# Altium schematic sheet Quadrature Mixers [FIXED WITH BIASING].SchDoc
size B; SheetNumber: 3; SheetTotal: 4
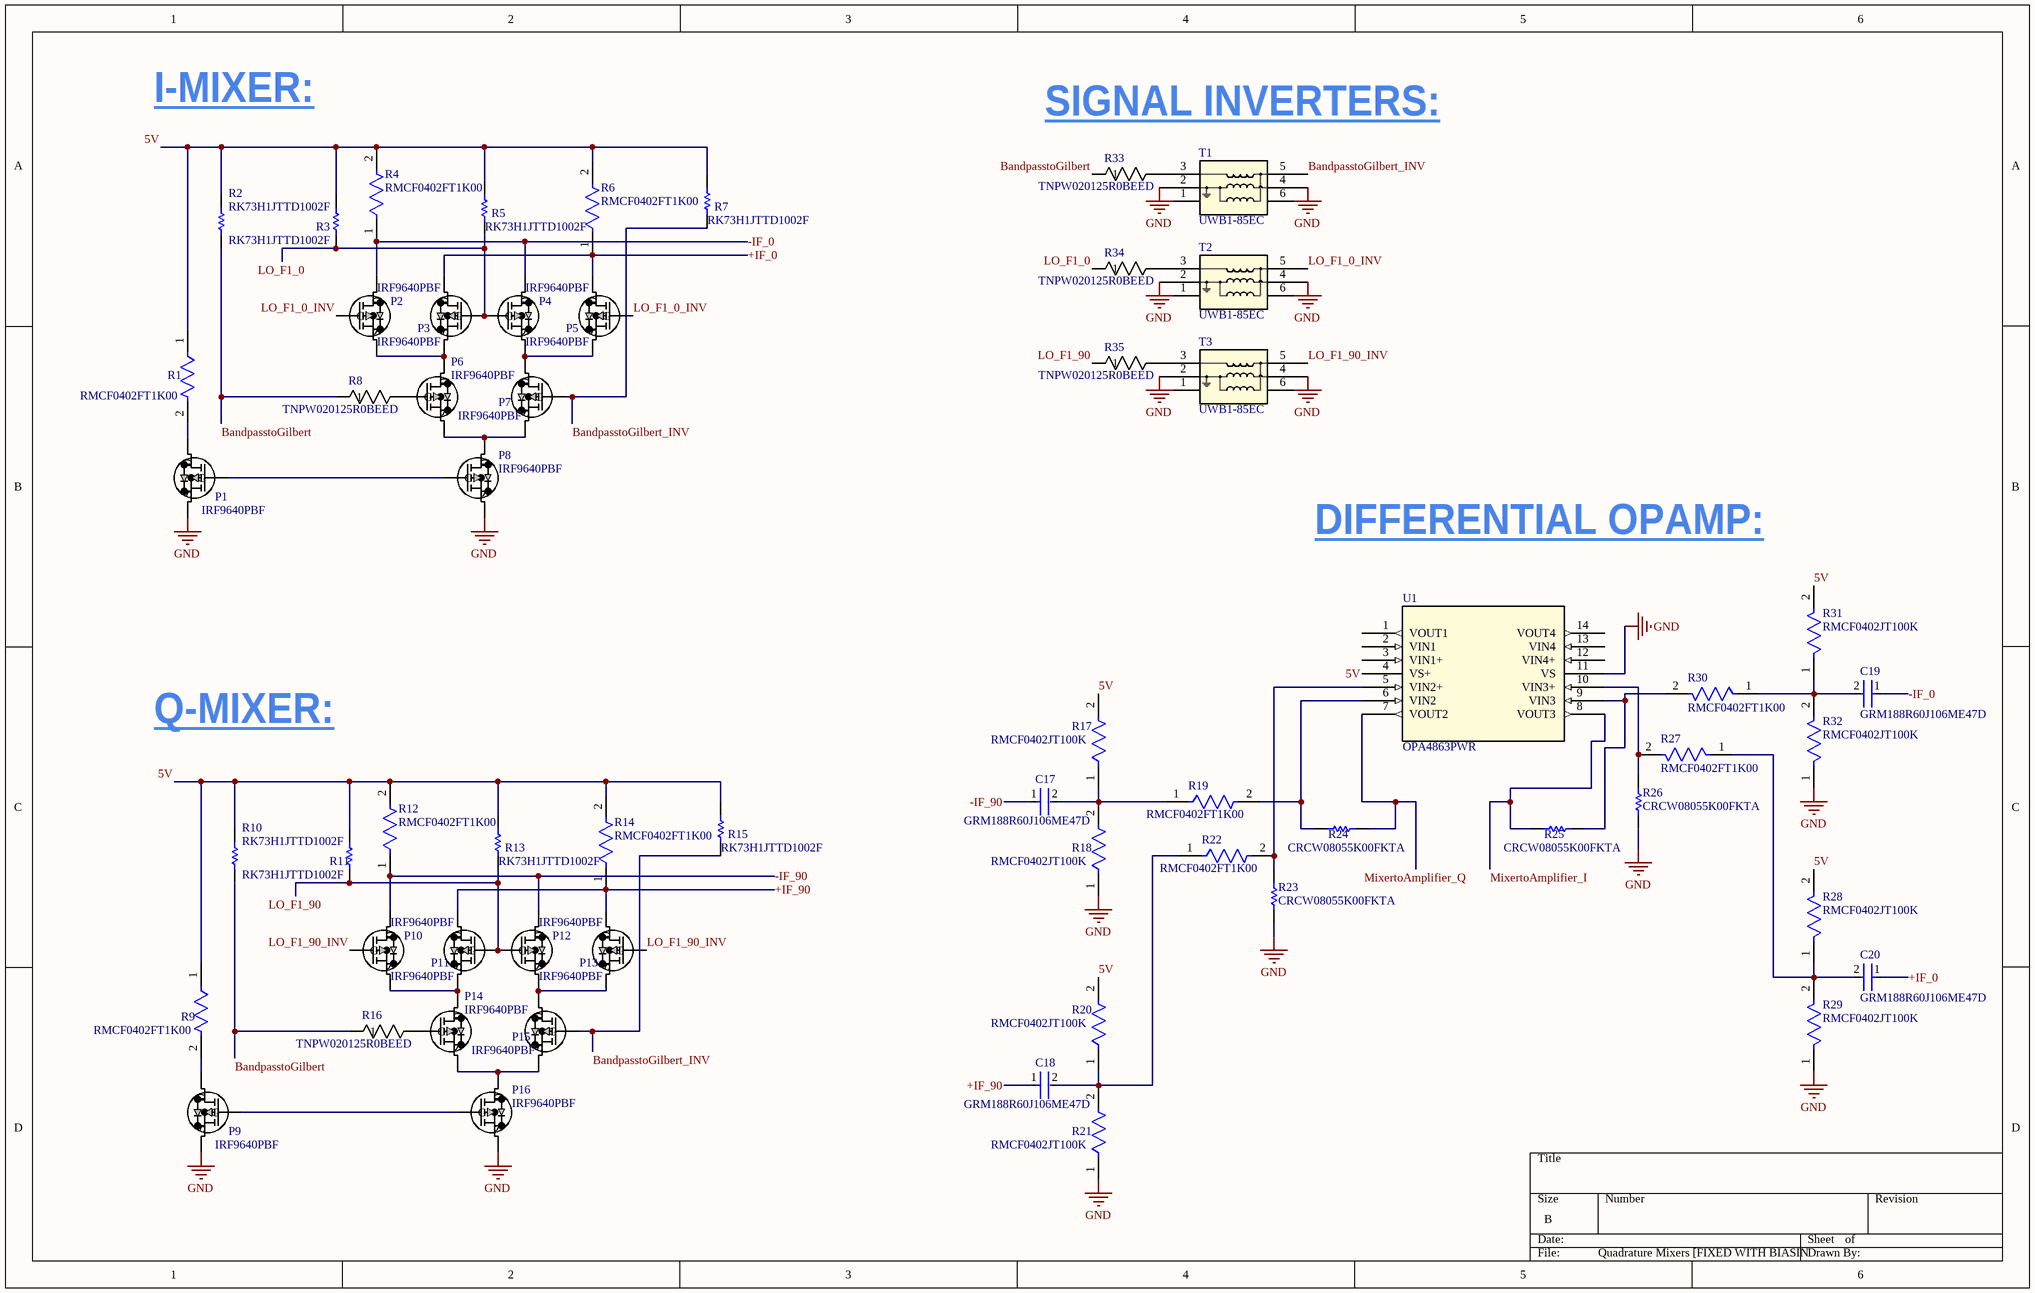
[diagram p0: Quadrature Mixers [FIXED WITH BIASING].SchDoc]

## Parts
C17  GRM188R60J106ME47D  [FP-GRM188-0_1-e0_2_0_55-IPC_A]
C18  GRM188R60J106ME47D  [FP-GRM188-0_1-e0_2_0_55-IPC_A]
C19  GRM188R60J106ME47D  [FP-GRM188-0_1-e0_2_0_55-IPC_A]
C20  GRM188R60J106ME47D  [FP-GRM188-0_1-e0_2_0_55-IPC_A]
P1  IRF9640PBF  [TO220AB_VIS]
P2  IRF9640PBF  [TO220AB_VIS]
P3  IRF9640PBF  [TO220AB_VIS]
P4  IRF9640PBF  [TO220AB_VIS]
P5  IRF9640PBF  [TO220AB_VIS]
P6  IRF9640PBF  [TO220AB_VIS]
P7  IRF9640PBF  [TO220AB_VIS]
P8  IRF9640PBF  [TO220AB_VIS]
P9  IRF9640PBF  [TO220AB_VIS]
P10  IRF9640PBF  [TO220AB_VIS]
P11  IRF9640PBF  [TO220AB_VIS]
P12  IRF9640PBF  [TO220AB_VIS]
P13  IRF9640PBF  [TO220AB_VIS]
P14  IRF9640PBF  [TO220AB_VIS]
P15  IRF9640PBF  [TO220AB_VIS]
P16  IRF9640PBF  [TO220AB_VIS]
R1  RMCF0402FT1K00  [FP-RMCF0402-MFG]
R2  RK73H1JTTD1002F  [RESC1608X55X30ML20T10]
R3  RK73H1JTTD1002F  [RESC1608X55X30ML20T10]
R4  RMCF0402FT1K00  [FP-RMCF0402-MFG]
R5  RK73H1JTTD1002F  [RESC1608X55X30ML20T10]
R6  RMCF0402FT1K00  [FP-RMCF0402-MFG]
R7  RK73H1JTTD1002F  [RESC1608X55X30ML20T10]
R8  TNPW020125R0BEED  [RES_TNPW0201_VIS]
R9  RMCF0402FT1K00  [FP-RMCF0402-MFG]
R10  RK73H1JTTD1002F  [RESC1608X55X30ML20T10]
R11  RK73H1JTTD1002F  [RESC1608X55X30ML20T10]
R12  RMCF0402FT1K00  [FP-RMCF0402-MFG]
R13  RK73H1JTTD1002F  [RESC1608X55X30ML20T10]
R14  RMCF0402FT1K00  [FP-RMCF0402-MFG]
R15  RK73H1JTTD1002F  [RESC1608X55X30ML20T10]
R16  TNPW020125R0BEED  [RES_TNPW0201_VIS]
R17  RMCF0402JT100K  [FP-RMCF0402-MFG]
R18  RMCF0402JT100K  [FP-RMCF0402-MFG]
R19  RMCF0402FT1K00  [FP-RMCF0402-MFG]
R20  RMCF0402JT100K  [FP-RMCF0402-MFG]
R21  RMCF0402JT100K  [FP-RMCF0402-MFG]
R22  RMCF0402FT1K00  [FP-RMCF0402-MFG]
R23  CRCW08055K00FKTA  [RESC2013X50X30ML20T20]
R24  CRCW08055K00FKTA  [RESC2013X50X30ML20T20]
R25  CRCW08055K00FKTA  [RESC2013X50X30ML20T20]
R26  CRCW08055K00FKTA  [RESC2013X50X30ML20T20]
R27  RMCF0402FT1K00  [FP-RMCF0402-MFG]
R28  RMCF0402JT100K  [FP-RMCF0402-MFG]
R29  RMCF0402JT100K  [FP-RMCF0402-MFG]
R30  RMCF0402FT1K00  [FP-RMCF0402-MFG]
R31  RMCF0402JT100K  [FP-RMCF0402-MFG]
R32  RMCF0402JT100K  [FP-RMCF0402-MFG]
R33  TNPW020125R0BEED  [RES_TNPW0201_VIS]
R34  TNPW020125R0BEED  [RES_TNPW0201_VIS]
R35  TNPW020125R0BEED  [RES_TNPW0201_VIS]
T1  UWB1-85EC  [UWB1UWB2_COC]
T2  UWB1-85EC  [UWB1UWB2_COC]
T3  UWB1-85EC  [UWB1UWB2_COC]
U1  OPA4863PWR  [PW14_TEX]

## Nets
GND: P1.3(S) P8.3(S) P9.3(S) P16.3(S) R18.1 R21.1 R23.1 R26.1 R29.1 R32.1 T1.2 T1.4 T2.2 T2.4 T3.2 T3.4 U1.11(VS)
5V: R1.1 R2.2 R3.2 R4.2 R5.2 R6.2 R7.2 R9.1 R10.2 R11.2 R12.2 R13.2 R14.2 R15.2 R17.2 R20.2 R28.2 R31.2 U1.4(VS+)
+IF_0: C20.1 P3.2(D) P5.2(D) R6.1
+IF_90: C18.1 P11.2(D) P13.2(D) R14.1
-IF_0: C19.1 P2.2(D) P4.2(D) R4.1
-IF_90: C17.1 P10.2(D) P12.2(D) R12.1
BandpasstoGilbert: R2.1 R8.1 R10.1 R16.1 R33.1
BandpasstoGilbert_INV: P7.1(G) P15.1(G) R7.1 R15.1 T1.5
LO_F1_0: P3.1(G) P4.1(G) R3.1 R5.1 R34.1
LO_F1_0_INV: P2.1(G) P5.1(G) T2.5
LO_F1_90: P11.1(G) P12.1(G) R11.1 R13.1 R35.1
LO_F1_90_INV: P10.1(G) P13.1(G) T3.5
MixertoAmplifier_I: R25.1 U1.8(VOUT3)
MixertoAmplifier_Q: R24.2 U1.7(VOUT2)
NetC17_2: C17.2 R17.1 R18.2 R19.1
NetC18_2: C18.2 R20.1 R21.2 R22.1
NetC19_2: C19.2 R30.1 R31.1 R32.2
NetC20_2: C20.2 R27.1 R28.1 R29.2
NetP1_1: P1.1(G) P8.1(G)
NetP1_2: P1.2(D) R1.2
NetP2_3: P2.3(S) P3.3(S) P6.2(D)
NetP4_3: P4.3(S) P5.3(S) P7.2(D)
NetP6_1: P6.1(G) R8.2
NetP6_3: P6.3(S) P7.3(S) P8.2(D)
NetP9_1: P9.1(G) P16.1(G)
NetP9_2: P9.2(D) R9.2
NetP10_3: P10.3(S) P11.3(S) P14.2(D)
NetP12_3: P12.3(S) P13.3(S) P15.2(D)
NetP14_1: P14.1(G) R16.2
NetP14_3: P14.3(S) P15.3(S) P16.2(D)
NetR19_2: R19.2 R24.1 U1.6(VIN2)
NetR22_2: R22.2 R23.2 U1.5(VIN2+)
NetR25_2: R25.2 R30.2 U1.9(VIN3)
NetR26_2: R26.2 R27.2 U1.10(VIN3+)
NetR33_2: R33.2 T1.3
NetR34_2: R34.2 T2.3
NetR35_2: R35.2 T3.3

Not connected (* = marked no-connect by the designer): T1 1 6; T2 1 6; T3 1 6; U1 1(VOUT1) 2(VIN1) 3(VIN1+) 12(VIN4+) 13(VIN4) 14(VOUT4)

## Notes on the sheet
- I-MIXER:
- SIGNAL INVERTERS:
- DIFFERENTIAL OPAMP:
- Q-MIXER:

## Library data of the parts
C17-C20 = CMP-2006-02792-2: Chip Multilayer Ceramic Capacitors for General Purpose, 0603, 10uF, X5R, 15%, 20%, 6.3V; Packaging: Tape and Reel; Voltage Rating (DC): 6.3V; Width: 0.031inch; Termination: SMD/SMT; Dielectric: X5R; Package Quantity: 4000; Voltage Rating: 6.3V; Capacitance: 10uF; Case/Package: 0603; Min Operating Temperature: -55°C; Voltage: 6.3V; Length: 1.6mm; Thickness: 0.035inch; Lead Free: Lead Free; Depth: 0.8mm; Case Code (Imperial): 0603; Max Operating Temperature: 85°C; Material: Ceramic; Height: 0.8mm; Tolerance: 20%; Mount: Surface Mount; REACH SVHC: No SVHC; Radiation Hardening: No; Case Code (Metric): 1608
P1-P16 = IRF9640PBF: No Description Available; Mfr_Name: Vishay
R1 R4 R6 R9 R12 R14 R19 R22 R27 R30 = CMP-26527-000026-1: 1kΩ ±1% 0.063W 0402 Thick Film Chip Resistor AEC-Q200 compliant; Resistance: 1kR; Temperature Coefficient: 100ppm/°C; Power Rating: 63mW; Length: 1mm; RoHS Compliant: Yes; Construction: Rectangular; Height: 0.016inch; Size Code: 0402; Lead Free: Lead Free; Radiation Hardening: No; Tolerance: 1%; Width: 0.02inch; Military Standard: Not; Resistor Type: Thick Film; Number of Terminations: 2; Min Operating Temperature: -55°C; Max Operating Temperature: 155°C; Depth: 0.5mm; Features: Automotive AEC-Q200; Packaging: Tape and Reel; Case Code (Metric): 1005; Mount: Surface Mount; Contact Plating: Tin; Max Power Dissipation: 63mW; Case/Package: 0402; Case Code (Imperial): 0402; Series: RMCF
R2 R3 R5 R7 R10 R11 R13 R15 = CMP-2000-01099-1: Manufacturer: KOA Speer; Part Number: RK73H1JTTD1002F
R8 R16 R33-R35 = TNPW020125R0BEED: RES 25 OHM 0.1% 0.075W 0201; Mfr_Name: Vishay
R17 R18 R20 R21 R28 R29 R31 R32 = CMP-26527-006953-1: 100kΩ ±5% 0.063W 0402 Thick Film Chip Resistor AEC-Q200 compliant; Working Voltage: 50V; Temperature Coefficient: 100ppm/°C; Power Rating: 62.5mW; Resistance: 100kR; Max Power Dissipation: 63mW; Military Standard: Not; Features: Automotive AEC-Q200; Case Code (Metric): 1005; Max Operating Temperature: 155°C; Lead Free: Lead Free; Series: RMCF; Number of Terminations: 2; Radiation Hardening: No; Length: 1mm; Contact Plating: Tin; Depth: 0.5mm; Min Operating Temperature: -55°C; Technology: THICK FILM; Case/Package: 0402; RoHS Compliant: Yes; Construction: Rectangular; Tolerance: 5%; Packaging: Tape and Reel; Resistor Type: Thick Film; Height: 0.016inch; Width: 0.02inch; Mount: Surface Mount; Case Code (Imperial): 0402
R23-R26 = CMP-2001-04239-1: Manufacturer: Vishay Dale; Part Number: CRCW08055K00FKTA
T1-T3 = UWB1-85EC: • 3 dB bandwidth: 1 MHz to 8.5 GHz • 1/4 Watt RF input power • 250 mA max current rating • AEC-Q200 Grade 1 (–40°C to +125°C); Mfr_Name: Coilcraft; RefDes: RefDes; Type: Type
U1 = OPA4863PWR: No Description Available; Mfr_Name: Texas Instruments; Type: Linear; RefDes: RefDes